# EAGLE design ASM4004 (EAGLE 6.3)
DATABASE: ./../../../../../Components/TinyCircuits_Part_Database.txt
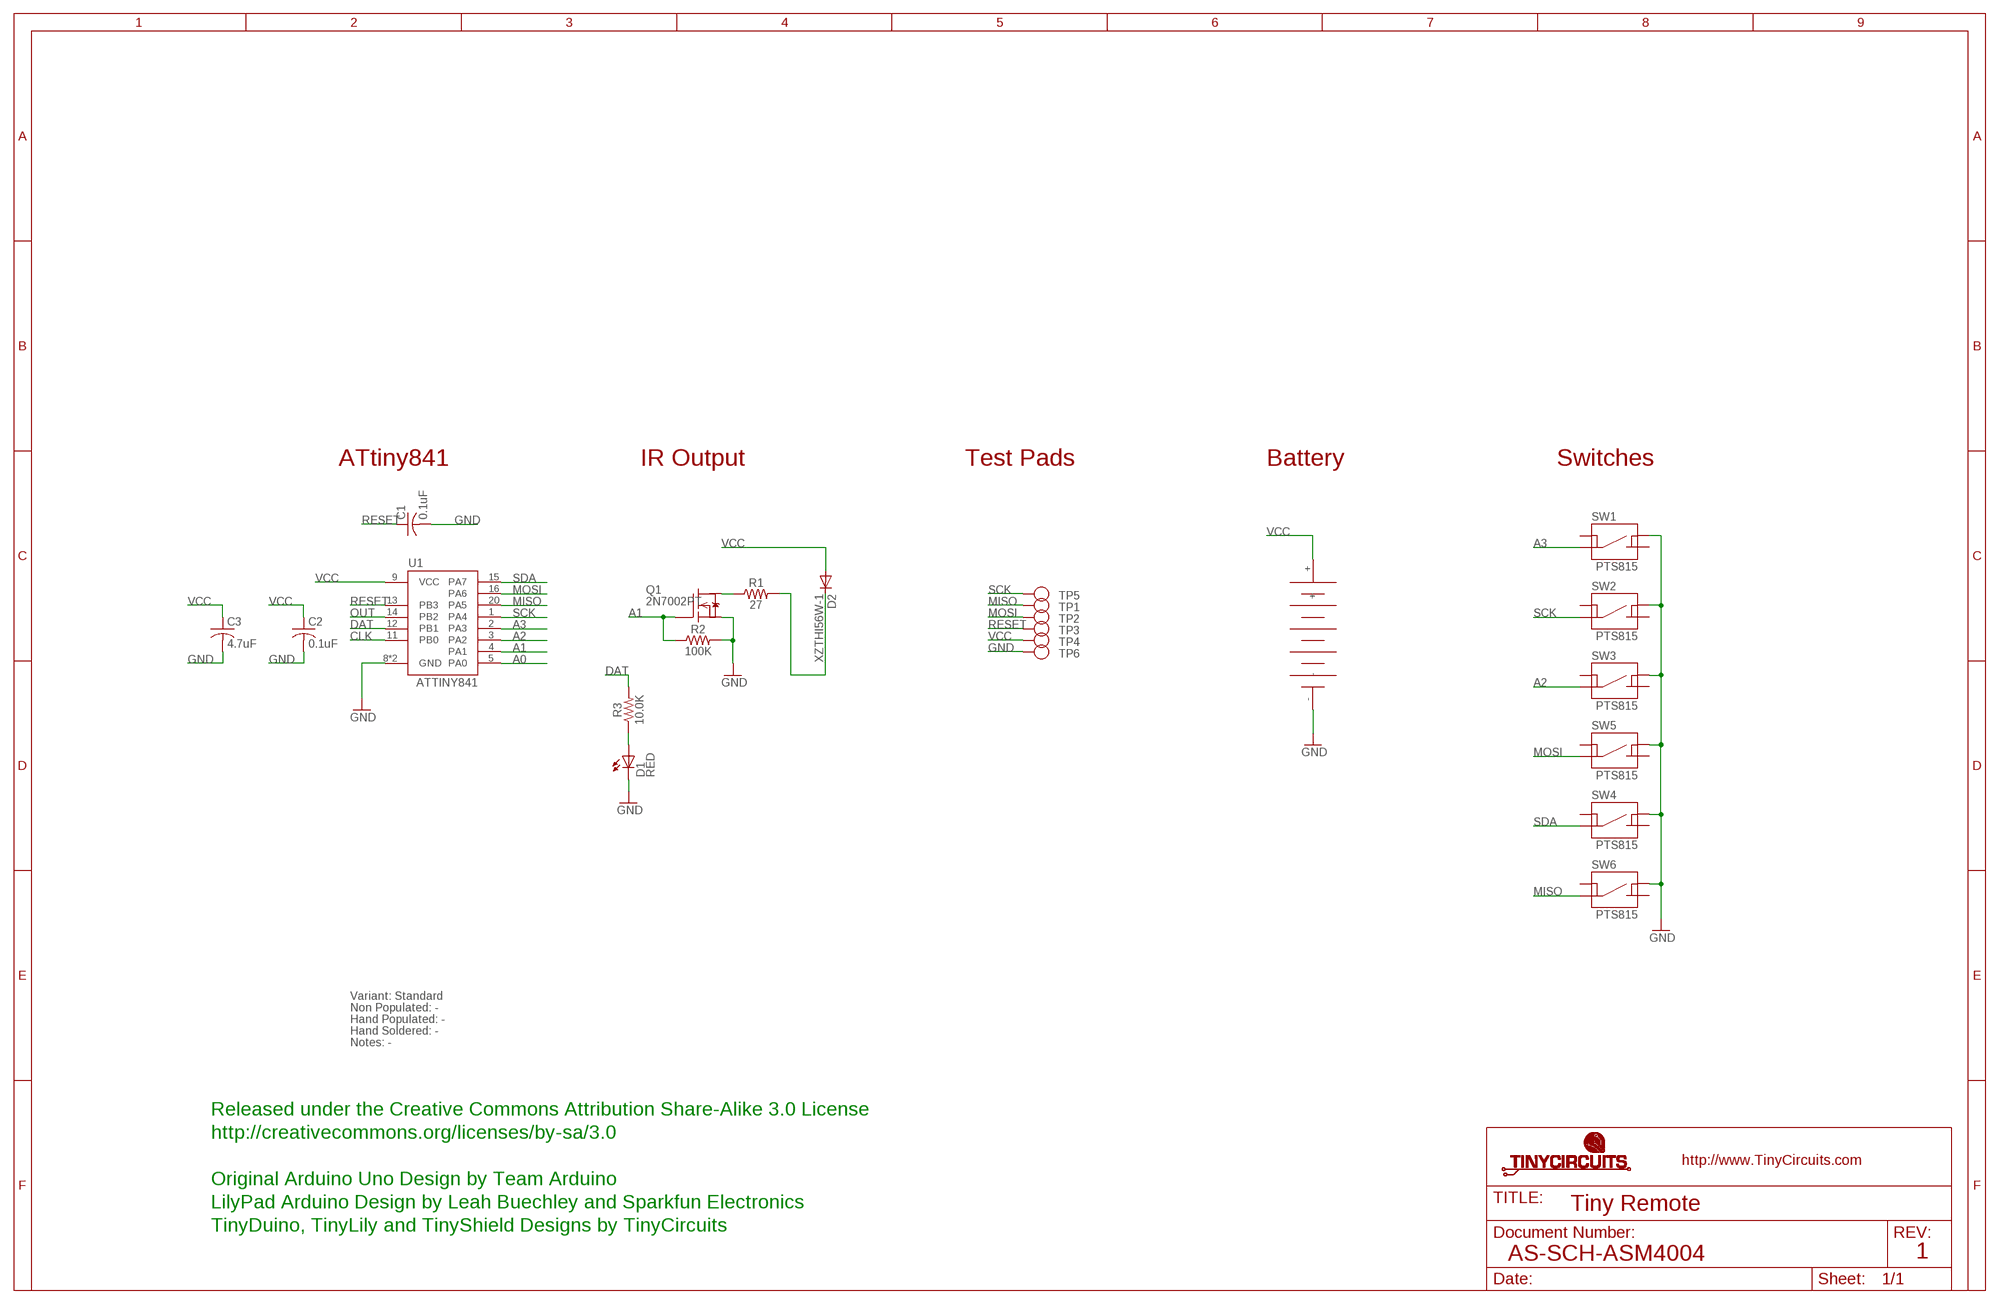
[diagram p0: schematic, sheet 1]

## Parts
C1  0.1uF  AS-ITM-00008  [C0402]
C2  0.1uF  AS-ITM-00008  [C0402]
C3  4.7uF  AS-ITM-00242  [C0402]
D1  RED  AS-ITM-00057  [0402_LED]
D2  XZTHI56W-1  AS-ITM-00551  [LED_SIDE_3.0X1.0]
J2  1225  AS-ITM-00468  [COIN_1220_SMD]
Q1  2N7002PT  AS-ITM-00110  [SOT-416]
R1  27  AS-ITM-00240  [0402]
R2  100K  AS-ITM-00004  [0402]
R3  10.0K  AS-ITM-00032  [0402]
SW1  PTS815  AS-ITM-00544  [PTS815]
SW2  PTS815  AS-ITM-00544  [PTS815]
SW3  PTS815  AS-ITM-00544  [PTS815]
SW4  PTS815  AS-ITM-00544  [PTS815]
SW5  PTS815  AS-ITM-00544  [PTS815]
SW6  PTS815  AS-ITM-00544  [PTS815]
TP1  TEST_POINT  [TEST_POINT_1MM]
TP2  TEST_POINT  [TEST_POINT_1MM]
TP3  TEST_POINT  [TEST_POINT_1MM]
TP4  TEST_POINT  [TEST_POINT_1MM]
TP5  TEST_POINT  [TEST_POINT_1MM]
TP6  TEST_POINT  [TEST_POINT_1MM]
U1  ATTINY841  AS-ITM-00255  [VQFN-20]

## Nets
A0: U1.5(PA0)
A1: Q1.1(G) R2.1 U1.4(PA1)
A2: SW3.1 U1.3(PA2)
A3: SW1.1 U1.2(PA3)
CLK: U1.11(PB0)
DAT: R3.2 U1.12(PB1)
GND: C1.2 C2.2 C3.2 D1.2(C) J2.- Q1.2(S) R2.2 SW1.4 SW2.4 SW3.4 SW4.4 SW5.4 SW6.4 TP6.P$1 U1.8(GND) U1.PAD(GND)
MISO: SW6.1 TP1.P$1 U1.20(PA5)
MOSI: SW5.1 TP2.P$1 U1.16(PA6)
N$1: Q1.3(D) R1.1
N$2: D2.C R1.2
N$18: D1.1(A) R3.1
OUT: U1.14(PB2)
RESET: C1.1 TP3.P$1 U1.13(PB3)
SCK: SW2.1 TP5.P$1 U1.1(PA4)
SDA: SW4.1 U1.15(PA7)
VCC: C2.1 C3.1 D2.A J2.+ TP4.P$1 U1.9(VCC)
Unconnected: SW1.2 SW1.3 SW2.2 SW2.3 SW3.2 SW3.3 SW4.2 SW4.3 SW5.2 SW5.3 SW6.2 SW6.3

## Notes on the sheet
- ATtiny841 | IR Output | Test Pads | Battery | Switches
- Variant: Standard
- Non Populated: -
- Hand Populated: -
- Hand Soldered: -
- Notes: -
- Released under the Creative Commons Attribution Share-Alike 3.0 License
- http://creativecommons.org/licenses/by-sa/3.0
- Original Arduino Uno Design by Team Arduino
- LilyPad Arduino Design by Leah Buechley and Sparkfun Electronics | Tiny Remote
- TinyDuino, TinyLily and TinyShield Designs by TinyCircuits
- AS-SCH-ASM4004 | 1

## Library data of the parts
C1 C2 = tinycircuits:AS-ITM-00008: CAP CER 0.1UF 16V 10% X5R 0402; PARTNO: AS-ITM-00008
C3 = tinycircuits:AS-ITM-00242: CAP CER 4.7UF 6.3V 20% X5R 0402; PARTNO: AS-ITM-00242
D1 = tinycircuits:AS-ITM-00057: LED 0402 RED WTR CLR SMD; PARTNO: AS-ITM-00057
D2 = tinycircuits:AS-ITM-00551: EMITTER IR 880NM 50MA SMD; PARTNO: AS-ITM-00551
J2 = tinycircuits:AS-ITM-00468: HOLDER COIN CELL 1225; PARTNO: AS-ITM-00468
Q1 = tinycircuits:AS-ITM-00110: MOSFET N-CH SGL 60V SOT-416; PARTNO: AS-ITM-00110; PNPROTATION: 270
R1 = tinycircuits:AS-ITM-00240: RES 27 OHM 1/16W 5% 0402 SMD; PARTNO: AS-ITM-00240; VALUE: 27.0
R2 = tinycircuits:AS-ITM-00004: RES 100K OHM 1/16W 1% 0402; PARTNO: AS-ITM-00004
R3 = tinycircuits:AS-ITM-00032: RES 10.0K OHM 1/16W 1% 0402 SMD; PARTNO: AS-ITM-00032
SW1-SW6 = tinycircuits:AS-ITM-00544: TACT SWITCH 4.2 X 3.2, 2.5 MM H, 180GF; PARTNO: AS-ITM-00544
TP1-TP6 = tinycircuits:TEST_POINT: Test point, no drill
U1 = tinycircuits:AS-ITM-00255: IC MCU 8BIT 8KB FLASH 20VQFN; PARTNO: AS-ITM-00255; PNPROTATION: 0

## Board
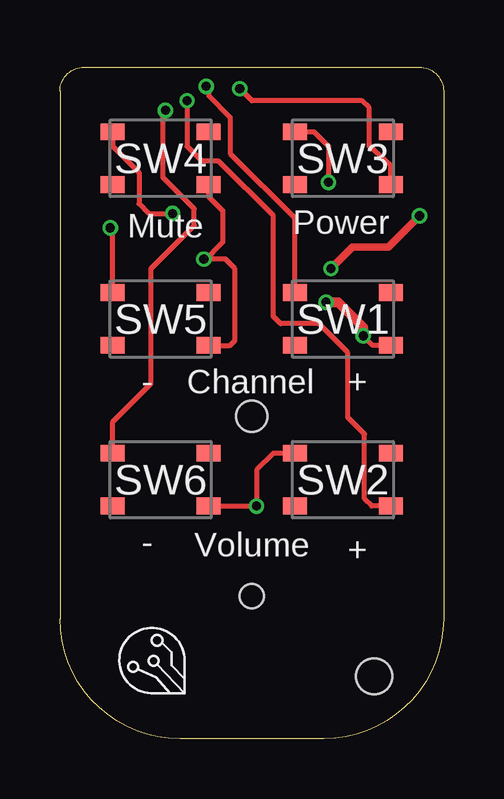
[diagram p1: board, top side]
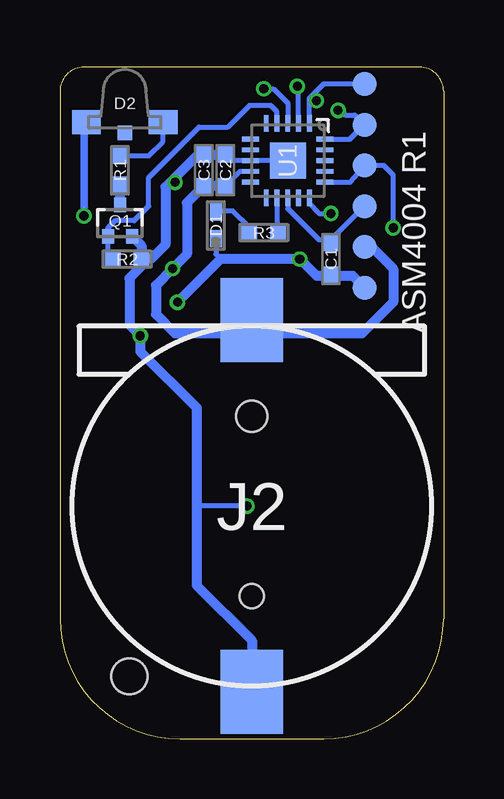
[diagram p2: board, bottom side, seen from below]

Size 16 x 28 mm. Coordinates in mm from the lower left corner, seen from the top.
Outline: 11,0 5,0 arc-90 0,5 0,27 arc-90 1,28 15,28 arc-90 16,27 16,5 arc-90 11,0
Copper layers (1*16): Top 0.035mm / dielectric 1.5mm / Bottom 0.035mm
Design rules "default *": minimum track width 7mil, minimum drill 15mil, track to track 8mil, track to pad 8mil, pad to pad 8mil, via to via 8mil, smd to smd 8mil, copper to edge 7mil, drill to drill 8mil, minimum pad ring 8mil, minimum via ring 5mil, stop-mask expansion 4mil, vias tented up to drill 25mil, thermal gap 10mil
Holes 1.5 mm at 13.1,2.6
bRestrict: 4 lines

### Footprints (pad centres in the part's own frame; a part is rotated, then mirrored left to right if it is on the bottom)
C0402 = smd 0.65 x 0.6: 1 -0.65,0; 2 0.65,0
0402_LED = smd 0.7 x 0.5: 1 -0.55,0; 2 0.55,0
LED_SIDE_3.0X1.0 = smd 1.2 x 1: A -1.6,0; C 1.6,0 | smd 0.6 x 0.6: NC 0,-0.45
COIN_1220_SMD = smd 2.6 x 3.5: + 0,-7.75; - 0,7.75 | hole 1: 0,3.75 | hole 1.3: 0,-3.75
SOT-416 = smd 0.5 x 0.6: 1 -0.5,-0.65; 2 0.5,-0.65; 3 0,0.65
0402 = smd 0.65 x 0.55: 1 -0.6,0; 2 0.6,0
PTS815 = smd 1 x 0.7: 1 -2,1.1; 2 2,1.1; 3 -2,-1.1; 4 2,-1.1
TEST_POINT_1MM = smd 1 x 1: P$1 0,0
VQFN-20 = smd 0.7 x 0.2: 1 -1.55,0.9; 2 -1.55,0.45; 3 -1.55,0; 4 -1.55,-0.45; 5 -1.55,-0.9; 11 1.55,-0.9; 12 1.55,-0.45; 13 1.55,0; 14 1.55,0.45; 15 1.55,0.9 | smd 0.2 x 0.7: 6 -0.9,-1.55; 7 -0.45,-1.55; 8 0,-1.55; 9 0.45,-1.55; 10 0.9,-1.55; 16 0.9,1.55; 17 0.45,1.55; 18 0,1.55; 19 -0.45,1.55; 20 -0.9,1.55 | smd 1.5 x 1.5: PAD 0,0

### Placement (x,y rotation side)
C1  4.7,20 270 bottom
C2  9.1,23.7 90 bottom
C3  10,23.7 90 bottom
D1  9.5,21.4 270 bottom
D2  13.3,25.7 0 bottom
J2  8,9.7 180 bottom
Q1  13.5,21.6 0 bottom
R1  13.5,23.7 90 bottom
R2  13.2,20 0 bottom
R3  7.5,21.1 0 bottom
SW1  11.8,17.5 0 top
SW2  11.8,10.8 180 top
SW3  11.8,24.2 180 top
SW4  4.2,24.2 0 top
SW5  4.2,17.5 0 top
SW6  4.2,10.8 0 top
TP1  3.3,25.6 0 bottom
TP2  3.3,23.9 0 bottom
TP3  3.3,22.2 0 bottom
TP4  3.3,20.5 0 bottom
TP5  3.3,27.3 0 bottom
TP6  3.3,18.8 0 bottom
U1  6.5,24.1 270 bottom
U$1  [DOCFIELD-TINYCIRCUITS-PCB]  26,-10 0 top  (outside the outline)

### Tracks (layer width: path | path; a pad name or v marks a point on that pad's centre or on a via)
A1
  Bottom 0.203: R2.1 14,20.2 Q1.1 14,21.3 13.7,21.6 12.9,21.6 12.3,22.2 12.3,23.4 10.2,25.5 9,25.5 8.1,26.4 7.2,26.4 6.95,26.15 U1.4
A2  (via drill 0.38)
  Top 0.203: SW3.1 13.8,23.9 12.9,24.7 12.9,26.3 12.6,26.6 8,26.6 v7.5,27.1
  Bottom 0.203: U1.3 6.5,26.5 7.1,27.1 v7.5,27.1
A3  (via drill 0.38)
  Top 0.203: v6.1,27.2 6.2,27.1 6.2,26.8 7.1,25.9 7.1,24.4 9.8,21.7 SW1.1
  Bottom 0.203: U1.2 6.05,27.15 v6.1,27.2
DAT
  Bottom 0.203: U1.12 6.95,21.15 R3.2
GND  (via drill 0.38)
  Top 0.203: SW6.4 v8.2,9.7 8.2,11.2 8.9,11.9 SW2.4 | SW4.4 6.2,22.6 6.8,22 6.8,20.7 6,19.9 v6,20 6.9,20 7.3,19.6 7.3,16.6 7.1,16.4 SW5.4 | SW1.4 13.05,16.4 v12.65,16.8 | SW3.4 10.6,25.3 11.2,24.7 v11.2,23.2
  Top 0.406: v11.1,18.2 11.6,18.2 12.65,17.15 v12.65,16.8
  Bottom 0.203: U1.PAD U1.8 8.85,24.1 C2.2 | v11.2,23.2 11,23.6 | v8.2,9.7 10.3,9.7 | D1.2 9.5,20.2 9.3,20
  Bottom 0.406: Q1.2 12.6,20.55 R2.2 | R2.2 12.2,20 11.6,20.6 11.6,23 11,23.6 10.25,24.35 C3.2 C2.2 | v11.1,18.2 9.3,20 v6,20 5.3,19.3 4.75,19.3 | R2.2 12.6,19.7 13.1,19.2 13.1,17.25 v12.65,16.8 12.65,16.15 10.3,13.8 10.3,9.7 10.3,6.4 8,4.1 J2.- | 4.75,19.3 C1.2 | 4.75,19.3 3.8,19.3 TP6.P$1
MISO  (via drill 0.38)
  Top 0.203: 4.3,26.3 v4.4,26.2 4.3,26.1 4.3,23.4 5.6,22.1 5.6,21.4 3.8,19.6 3.8,14.8 2.2,13.2 SW6.1
  Bottom 0.203: U1.20 3.9,25 TP1.P$1 3.7,26 4.1,26 4.3,26.2 v4.4,26.2
MOSI  (via drill 0.38)
  Top 0.203: SW5.1 2.2,21.2 v2.1,21.3
  Bottom 0.203: U1.16 3.9,23.2 TP2.P$1 2.5,23.9 2.1,23.5 v2.1,21.3
N$1
  Bottom 0.406: Q1.3 R1.1
N$2
  Bottom 0.203: R1.2 12.3,24.3 11.7,24.9 D2.C
N$18
  Bottom 0.203: R3.1 8.1,21.3 8.8,22 9.45,22 D1.1
RESET
  Bottom 0.203: U1.13 6.5,22.1 5.2,20.8 4.85,20.8 C1.1 4.65,20.7 4.65,20.85 TP3.P$1
SCK  (via drill 0.38)
  Top 0.203: v5.3,26.6 5.3,24.7 5.9,24.1 6.6,24.1 8.9,21.8 8.9,17.6 9.2,17.3 10.8,17.3 12,16.1 12,13.4 12.7,12.7 12.7,10 13,9.7 SW2.1
  Bottom 0.203: 5.5,26.8 5.6,26.7 U1.1 | 5.5,26.8 5,27.3 TP5.P$1 3.3,27.4 | v5.3,26.6 5.5,26.8
SDA  (via drill 0.38)
  Top 0.203: SW4.1 2.2,24.7 3.3,23.6 3.3,22.3 3.7,21.9 v4.7,21.9
  Bottom 0.203: U1.15 5.6,22.3 5.2,21.9 v4.7,21.9
VCC  (via drill 0.38)
  Top 0.305: v15,21.8 13.7,20.5 12.2,20.5 v11.3,19.6
  Bottom 0.203: U1.9 8.5,23.65 C2.1
  Bottom 0.305: D2.A 15,25.4 v15,21.8
  Bottom 0.406: TP4.P$1 3,20.5 2.1,19.6 2.1,18.2 3.4,16.9 8,16.9 | C2.1 C3.1 10.7,22.35 10.7,20.2 v11.3,19.6 12,18.9 12,17.7 11.2,16.9 8,16.9 | J2.+ 8,16.9

### Text on the board
tPlace: Mute | Power | - | Channel | + | - | Volume | +
bPlace: ASM4004 R1
Document: FABRICATION DRAWING | NOTES: | 1. PRINTED CIRCUIT BOARD MADE FROM NEMA GRADE FR-4 EPOXY LAMINATE | WITH 1 OUNCE COPPER PLATING AND .024 THICKNESS. | 2. ALL DIMENSIONS ARE GIVEN IN INCHES. | 3. CIRCUIT PATHS ARE FOR REFERENCE ONLY. | 4. HOLE SIZES SHOWN ARE FINISHED DIAMETERS AFTER PLATING. | 5. BOARD PLATED USING REFLOW OR SIMILAR METHOD. | 6. BOARD TO HAVE BLUE SOLDER MASK ON PLATED SURFACES USING WET FILM | 7. SILKSCREEN BOARD USING WHITE INK. | SR100 OR SR1010 EPOXY. EQUIVALENT WET OR DRY FILM MAY BE USED. | 8. THE FOLLOWING INFORMATION APPLIES TO THIS BOARD: | * 2 COPPER LAYERS | * .024 BOARD THICKNESS | * REQUIRES TOP SIDE SILKSCREEN | Released under the Creative Commons Attribution Share-Alike 3.0 License | http://creativecommons.org/licenses/by-sa/3.0 | Original Arduino Uno Design by Team Arduino | LilyPad Arduino Design by Leah Buechley and Sparkfun Electronics | TinyDuino, TinyLily and TinyShield Designs by TinyCircuits | Tiny Remote | AS-PCB-ASM4004 | 1